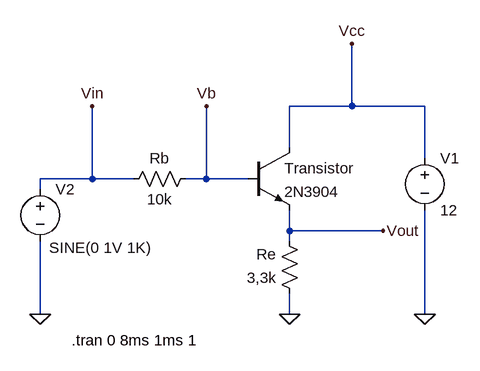
[diagram p0: schematic Task1.asc]
Task1.asc, the LTspice schematic file:
Version 4
SHEET 1 880 680
WIRE 192 64 192 -32
WIRE 192 64 96 64
WIRE 304 64 192 64
WIRE 96 128 96 64
WIRE 304 144 304 64
WIRE -208 176 -208 64
WIRE -208 176 -288 176
WIRE -144 176 -208 176
WIRE -32 176 -32 64
WIRE -32 176 -64 176
WIRE 32 176 -32 176
WIRE -288 192 -288 176
WIRE 96 256 96 224
WIRE 240 256 96 256
WIRE 96 272 96 256
WIRE -288 384 -288 272
WIRE 96 384 96 352
WIRE 304 384 304 224
FLAG 304 384 0
FLAG -32 64 Vb
FLAG -208 64 Vin
FLAG -288 384 0
FLAG 240 256 Vout
FLAG 192 -32 Vcc
FLAG 96 384 0
SYMBOL voltage 304 128 R0
WINDOW 123 0 0 Left 0
WINDOW 39 0 0 Left 0
SYMATTR InstName V1
SYMATTR Value 12
SYMBOL res 112 368 R180
WINDOW 0 36 76 Left 2
WINDOW 3 36 40 Left 2
SYMATTR InstName Re
SYMATTR Value 3,3k
SYMBOL npn 32 128 R0
SYMATTR InstName Transistor
SYMATTR Value 2N3904
SYMBOL res -48 160 R90
WINDOW 0 0 56 VBottom 2
WINDOW 3 32 56 VTop 2
SYMATTR InstName Rb
SYMATTR Value 10k
SYMBOL voltage -288 176 R0
WINDOW 123 0 0 Left 0
WINDOW 39 0 0 Left 0
WINDOW 3 14 106 Left 2
SYMATTR InstName V2
SYMATTR Value SINE(0 1V 1K)
TEXT -240 424 Left 2 !.tran 0 8ms 1ms 1

The netlist it stands for:
* Task1.asc
V1 Vcc 0 12
Re 0 Vout 3,3k
Q§Transistor Vcc Vb Vout 0 2N3904
Rb Vb Vin 10k
V2 Vin 0 SINE(0 1V 1K)
.model NPN NPN
.model PNP PNP
.lib standard.bjt
.tran 0 8ms 1ms 1
.backanno
.end